# EAGLE design realParking (EAGLE 6.5.0)
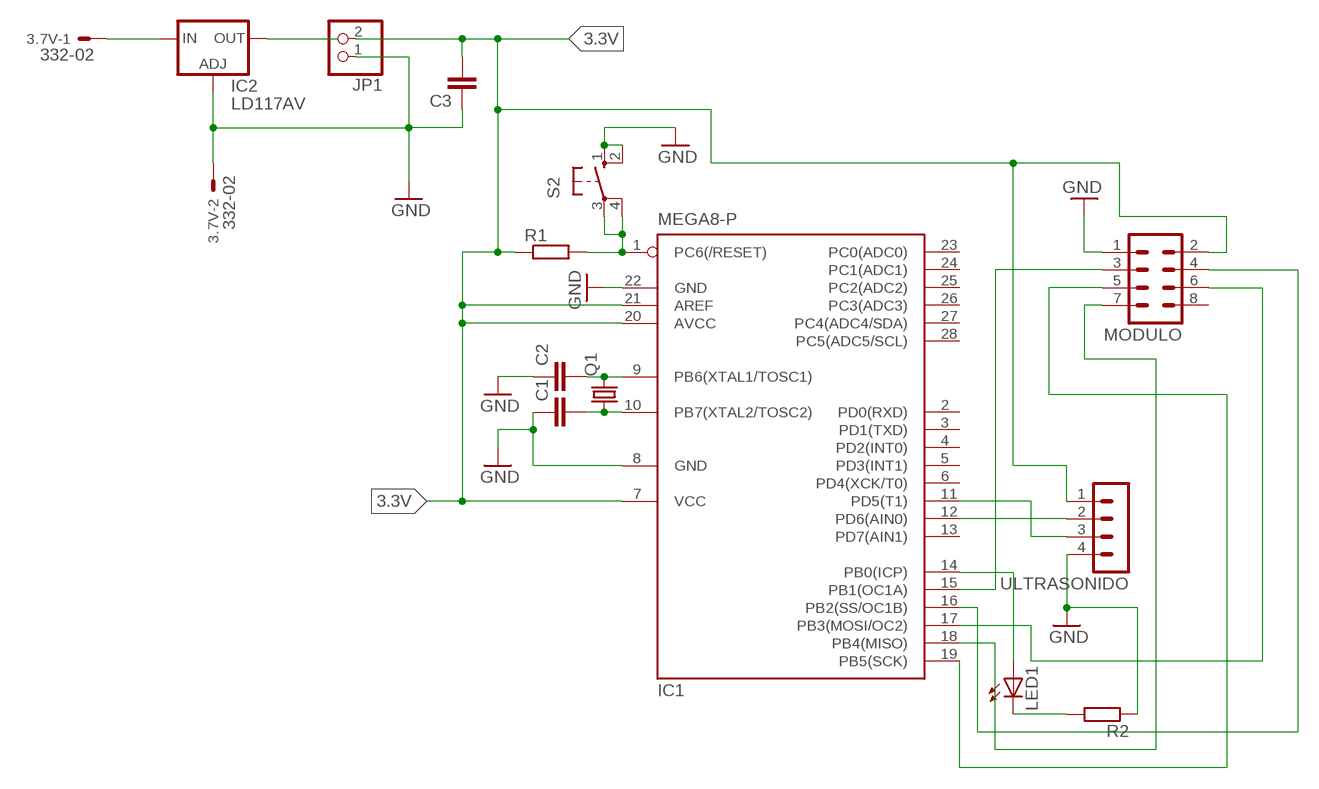
[diagram p0: schematic, sheet 1]

## Parts
3.7V  332-02  [332-02]
C1  C2,5-3  [C2.5-3]
C2  C2,5-3  [C2.5-3]
C3  C2,5-3  [C2.5-3]
IC1  MEGA8-P  [DIL28-3]
IC2  LD117AV  [TO220L1]
JP1  PINHD-1X2  [1X02]
LED1  LED5MM  [LED5MM]
MODULO  MA04-2  [MA04-2]
Q1  CRYSTALTC26V  [TC26V]
R1  R-EU_0204/5  [0204/5]
R2  R-EU_0204/5  [0204/5]
S2  10-XX  [B3F-10XX]
ULTRASONIDO  MA04-1  [MA04-1]

## Nets
3.3V: C3.2 IC1.7(VCC) IC1.20(AVCC) IC1.21(AREF) JP1.2 MODULO.2 R1.1 ULTRASONIDO.1
GND: 3.7V.2 C1.1 C2.1 C3.1 IC1.8(GND) IC1.22(GND) IC2.1(ADJ) JP1.1 MODULO.1 R2.1 S2.1(S) S2.2(S1) ULTRASONIDO.4
N$1: IC2.2(OUT)
N$2: 3.7V.1 IC2.3(IN)
N$3: IC1.12(PD6(AIN0)) ULTRASONIDO.2
N$4: IC1.11(PD5(T1)) ULTRASONIDO.3
N$6: LED1.K(C) R2.2
N$8: IC1.14(PB0(ICP)) LED1.A
N$9: IC1.15(PB1(OC1A)) MODULO.3
N$10: IC1.16(PB2(SS/OC1B)) MODULO.4
N$11: IC1.17(PB3(MOSI/OC2)) MODULO.6
N$12: IC1.18(PB4(MISO)) MODULO.7
N$13: IC1.19(PB5(SCK)) MODULO.5
N$14: C2.2 IC1.9(PB6(XTAL1/TOSC1)) Q1.2
N$15: C1.2 IC1.10(PB7(XTAL2/TOSC2)) Q1.1
N$16: IC1.1(PC6(/RESET)) R1.2 S2.3(P) S2.4(P1)
Unconnected: IC1.2(PD0(RXD)) IC1.3(PD1(TXD)) IC1.4(PD2(INT0)) IC1.5(PD3(INT1)) IC1.6(PD4(XCK/T0)) IC1.13(PD7(AIN1)) IC1.23(PC0(ADC0)) IC1.24(PC1(ADC1)) IC1.25(PC2(ADC2)) IC1.26(PC3(ADC3)) IC1.27(PC4(ADC4/SDA)) IC1.28(PC5(ADC5/SCL)) MODULO.8

## Library data of the parts
3.7V = con-garry:332-02: 2 Pin - 2mm Dual Row Source: www.mpe-connector.de / garry_shortform_2012.pdf
C1-C3 = capacitor-wima:C: CAPACITOR naming: grid - package width
IC1 = atmel:MEGA8-P: MICROCONTROLLER 8 Kbytes FLASH, 1 kbytes SRAM, 512 bytes EEPROM, USART, 4-channel 10 bit ADC, 2-channel 8 bit ADC Pin compatible with Atmega48, ATMega88, ATMega168 Source: avr.lbr; OC_FARNELL: unknown; OC_NEWARK: unknown
IC2 = v-reg:LD117A?*: Low drop fixed and adjustable positive voltage regulators 1 A Source: http://www.st.com/stonline/products/literature/ds/7194/ld1117axx.pdf
JP1 = pinhead:PINHD-1X2: PIN HEADER
LED1 = led:LED: LED OSRAM: - CHIPLED LG R971, LG N971, LY N971, LG Q971, LY Q971, LO R971, LY R971 LH N974, LH R974 LS Q976, LO Q976, LY Q976 LO Q996 - Hyper CHIPLED LW Q18S LB Q993, LB Q99A, LB R99A - SideLED LS A670, LO A670, LY A670, LG A670, LP A670 LB A673, LV A673, LT A673, LW A673 LH A674 LY A675 LS A676, LA A676, LO A676, LY A676, LW A676 LS A679, LY A679, LG A679 - Hyper Micro SIDELED® LS Y876, LA Y876, LO Y876, LY Y876 LT Y87S - SmartLED LW L88C, LW L88S LB L89C, LB L89S, LG L890 LS L89K, LO L89K, LY L89K LS L896, LA L896, LO L896, LY L896 - TOPLED LS T670, LO T670, LY T670, LG T670, LP T670 LSG T670, LSP T670, LSY T670, LOP T670, LYG T670 LG T671, LOG T671, LSG T671 LB T673, LV T673, LT T673, LW T673 LH T674 LS T676, LA T676, LO T676, LY T676, LB T676, LH T676, LSB T676, LW T676 LB T67C, LV T67C, LT T67C, LS T67K, LO T67K, LY T67K, LW E67C LS E67B, LA E67B, LO E67B, LY E67B, LB E67C, LV E67C, LT E67C LW T67C LS T679, LY T679, LG T679 LS T770, LO T770, LY T770, LG T770, LP T770 LB T773, LV T773, LT T773, LW T773 LH T774 LS E675, LA E675, LY E675, LS T675 LS T776, LA T776, LO T776, LY T776, LB T776 LHGB T686 LT T68C, LB T68C - Hyper Mini TOPLED® LB M676 - Mini TOPLED Santana® LG M470 LS M47K, LO M47K, LY M47K Source: http://www.osram.convergy.de LUXEON: - LUMILED® LXK2-PW12-R00, LXK2-PW12-S00, LXK2-PW14-U00, LXK2-PW14-V00 LXK2-PM12-R00, LXK2-PM12-S00, LXK2-PM14-U00 LXK2-PE12-Q00, LXK2-PE12-R00, LXK2-PE12-S00, LXK2-PE14-T00, LXK2-PE14-U00 LXK2-PB12-K00, LXK2-PB12-L00, LXK2-PB12-M00, LXK2-PB14-N00, LXK2-PB14-P00, LXK2-PB14-Q00 LXK2-PR12-L00, LXK2-PR12-M00, LXK2-PR14-Q00, LXK2-PR14-R00 LXK2-PD12-Q00, LXK2-PD12-R00, LXK2-PD12-S00 LXK2-PH12-R00, LXK2-PH12-S00 LXK2-PL12-P00, LXK2-PL12-Q00, LXK2-PL12-R00 Source: www.luxeon.com KINGBRIGHT: KA-3528ASYC Source: www.kingbright.com
MODULO = con-lstb:MA04-2: PIN HEADER; OC_FARNELL: unknown; OC_NEWARK: unknown
Q1 = crystal:CRYSTAL: CRYSTAL; OC_FARNELL: unknown; OC_NEWARK: unknown
R1 R2 = rcl:R-EU_: RESISTOR, European symbol
S2 = switch-omron:10-XX: OMRON SWITCH; MPN: B3F-1000; OC_FARNELL: 176432; OC_NEWARK: 36M3542
ULTRASONIDO = con-lstb:MA04-1: PIN HEADER; OC_FARNELL: unknown; OC_NEWARK: unknown

## Board
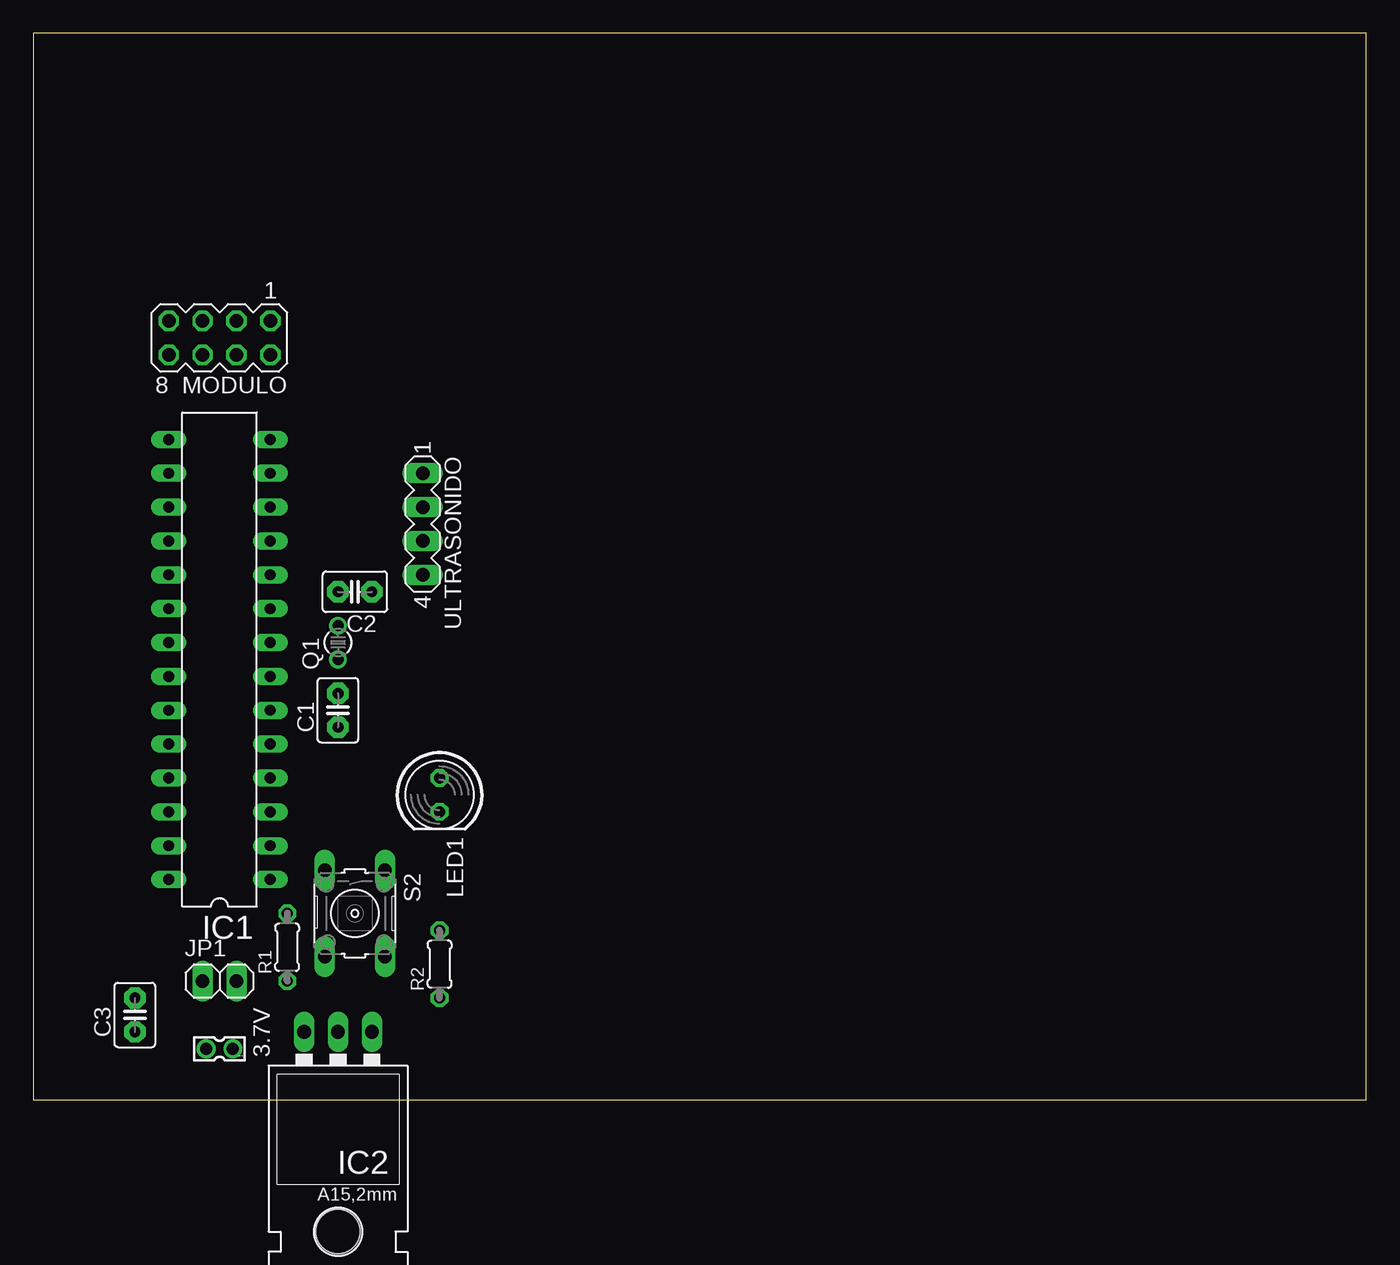
[diagram p1: board, top side]
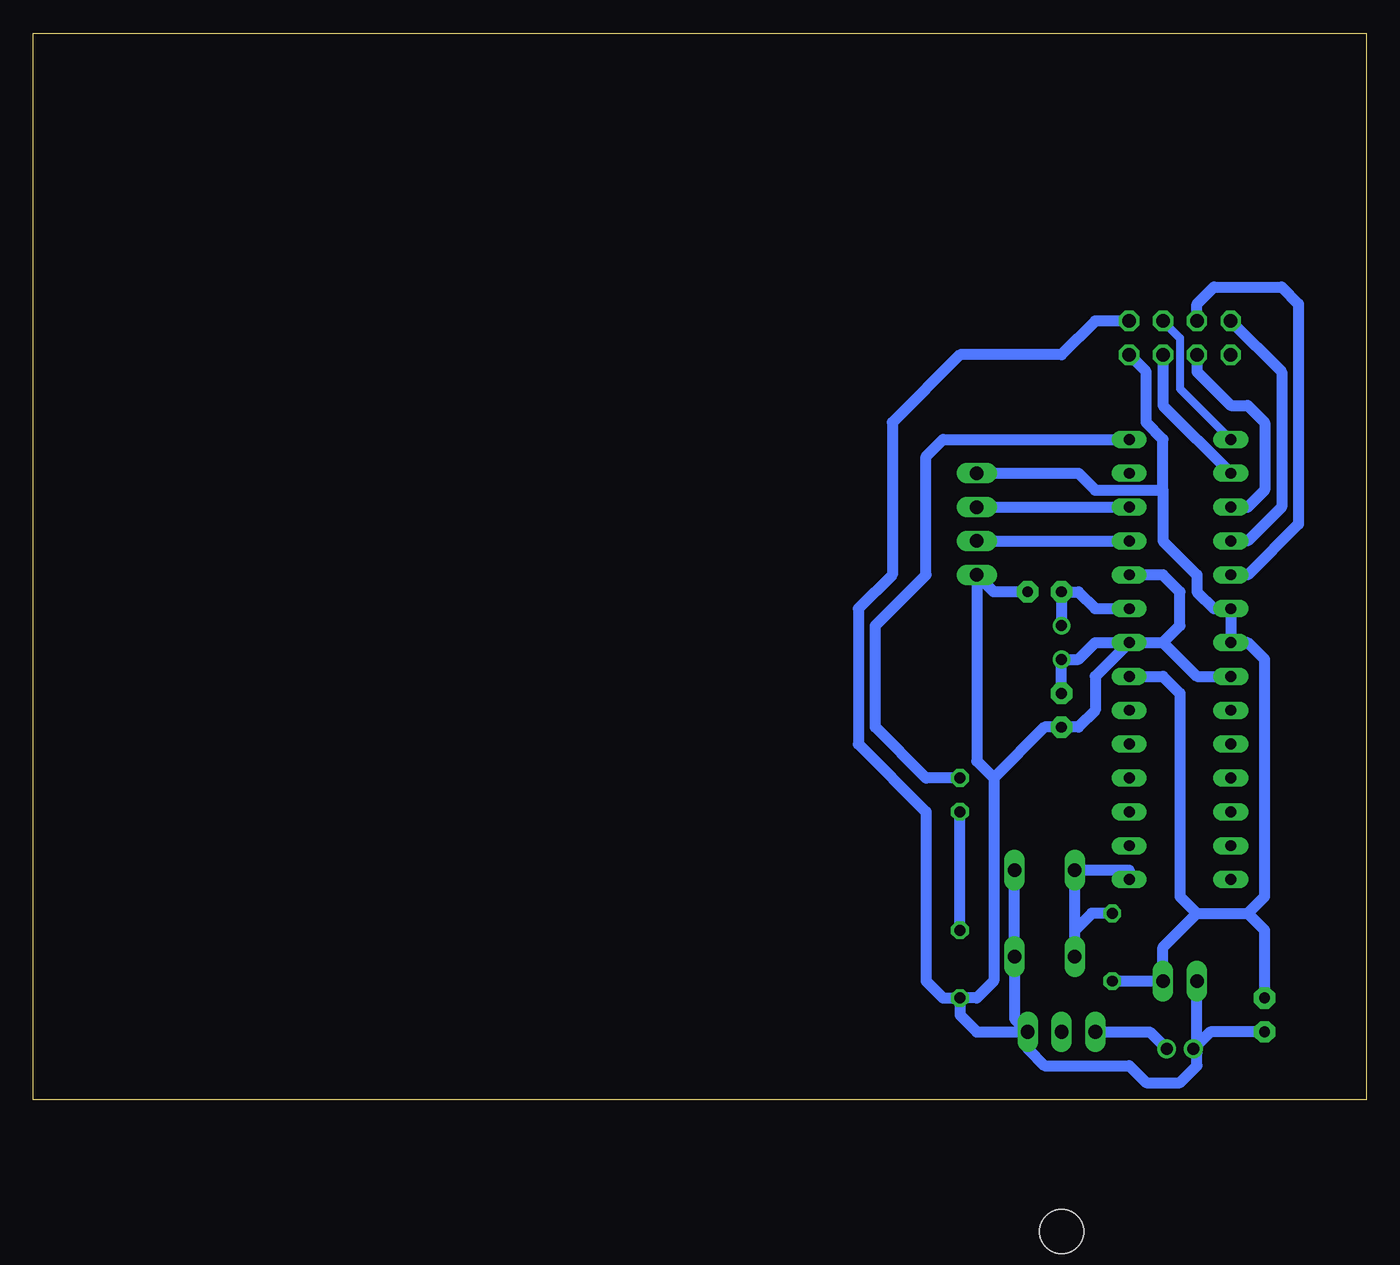
[diagram p2: board, bottom side, seen from below]

Size 100 x 80 mm. Coordinates in mm from the lower left corner, seen from the top.
Outline: 0,0 100,0 100,80 0,80 0,0
Copper layers (1*16): Top 0.035mm / dielectric 1.5mm / Bottom 0.035mm
Design rules "default": minimum track width 10mil, minimum drill 24mil, track to track 8mil, track to pad 8mil, pad to pad 8mil, via to via 8mil, smd to smd 8mil, copper to edge 40mil, drill to drill 8mil, minimum pad ring 10mil, minimum via ring 8mil, stop-mask expansion 4mil, vias tented up to drill 0mil, thermal gap 10mil

### Footprints (pad centres in the part's own frame; a part is rotated, then mirrored left to right if it is on the bottom)
332-02 = drill 0.9 pad 1.27: 1 0,-1; 2 0,1
C2.5-3 = drill 0.813 pad 1.6 octagon: 1 -1.27,0; 2 1.27,0
DIL28-3 = drill 0.813 long: 1 -16.51,-3.81; 2 -13.97,-3.81; 3 -11.43,-3.81; 4 -8.89,-3.81; 5 -6.35,-3.81; 6 -3.81,-3.81; 7 -1.27,-3.81; 8 1.27,-3.81; 9 3.81,-3.81; 10 6.35,-3.81; 11 8.89,-3.81; 12 11.43,-3.81; 13 13.97,-3.81; 14 16.51,-3.81; 15 16.51,3.81; 16 13.97,3.81; 17 11.43,3.81; 18 8.89,3.81; 19 6.35,3.81; 20 3.81,3.81; 21 1.27,3.81; 22 -1.27,3.81; 23 -3.81,3.81; 24 -6.35,3.81; 25 -8.89,3.81; 26 -11.43,3.81; 27 -13.97,3.81; 28 -16.51,3.81
TO220L1 = drill 1.016 long: 1 -2.54,-3.81; 2 0,-3.81; 3 2.54,-3.81 | hole 3.302: 0,11.176
1X02 = drill 1.016 long: 1 -1.27,0; 2 1.27,0
LED5MM = drill 0.813 octagon: A -1.27,0; K 1.27,0
MA04-2 = drill 1.016 octagon: 1 -3.81,-1.27; 2 -3.81,1.27; 3 -1.27,-1.27; 4 -1.27,1.27; 5 1.27,-1.27; 6 1.27,1.27; 7 3.81,-1.27; 8 3.81,1.27
TC26V = drill 0.813: 1 -1.27,0; 2 1.27,0
0204/5 = drill 0.813 octagon: 1 -2.54,0; 2 2.54,0
B3F-10XX = drill 1.016 long: 1 -3.251,2.261; 2 3.251,2.261; 3 -3.251,-2.261; 4 3.251,-2.261
MA04-1 = drill 1.016 long: 1 -3.81,0; 2 -1.27,0; 3 1.27,0; 4 3.81,0

### Placement (x,y rotation side)
3.7V  13.97,3.81 90 top
C1  22.86,29.21 90 top
C2  24.13,38.1 180 top
C3  7.62,6.35 90 top
IC1  13.97,33.02 90 top
IC2  22.86,1.27 180 top
JP1  13.97,8.89 0 top
LED1  30.48,22.86 270 top
MODULO  13.97,57.15 180 top
Q1  22.86,34.29 90 top
R1  19.05,11.43 90 top
R2  30.48,10.16 90 top
S2  24.13,13.97 270 top
ULTRASONIDO  29.21,43.18 270 top

### Tracks (layer width: path | path; a pad name or v marks a point on that pad's centre or on a via)
3.3V
  Bottom 0.813: IC1.7 15.24,31.75 13.97,30.48 13.97,15.24 12.7,13.97 | 12.7,13.97 8.89,13.97 | 8.89,13.97 7.62,15.24 7.62,33.02 8.89,34.29 IC1.21 IC1.20 11.43,36.83 12.7,38.1 12.7,39.37 15.24,41.91 15.24,45.72 | 12.7,13.97 15.24,11.43 JP1.2 R1.1 | C3.2 7.62,12.7 8.89,13.97 | 15.24,45.72 15.24,49.53 16.51,50.8 16.51,54.61 MODULO.2 | ULTRASONIDO.1 21.59,46.99 20.32,45.72 15.24,45.72
GND
  Bottom 0.813: 3.7V.2 12.7,3.81 JP1.1 | S2.1 S2.2 26.39,6.07 IC2.1 | C2.1 27.94,38.1 ULTRASONIDO.4 29.21,25.4 27.94,24.13 | R2.1 30.48,6.35 29.21,5.08 IC2.1 | IC1.22 12.7,31.75 15.24,34.29 IC1.8 20.32,31.75 20.32,29.21 21.59,27.94 C1.1 24.13,27.94 27.94,24.13 | MODULO.1 20.32,58.42 22.86,55.88 30.48,55.88 35.56,50.8 35.56,39.37 38.1,36.83 38.1,26.67 33.02,21.59 33.02,8.89 31.75,7.62 R2.1 | C3.1 11.7,5.08 3.7V.2 | 27.94,24.13 27.94,8.89 29.21,7.62 R2.1 | IC2.1 25.4,3.81 24.13,2.54 17.78,2.54 16.51,1.27 13.97,1.27 12.7,2.54 12.7,3.54 3.7V.2
N$2
  Bottom 0.813: IC2.3 16.24,5.08 3.7V.1
N$3
  Bottom 0.813: ULTRASONIDO.2 IC1.12
N$4
  Bottom 0.813: ULTRASONIDO.3 IC1.11
N$6
  Bottom 0.813: R2.2 LED1.K
N$8
  Bottom 0.813: LED1.A 33.02,24.13 36.83,27.94 36.83,35.56 33.02,39.37 33.02,48.26 31.75,49.53 IC1.14
N$9
  Bottom 0.61: MODULO.3 13.97,57.15 13.97,53.34 IC1.15
N$10
  Bottom 0.813: MODULO.4 15.24,52.07 IC1.16
N$11
  Bottom 0.813: MODULO.6 12.7,54.61 10.16,52.07 8.89,52.07 7.62,50.8 7.62,45.72 8.89,44.45 IC1.17
N$12
  Bottom 0.813: MODULO.7 6.35,54.61 6.35,44.45 8.89,41.91 IC1.18
N$13
  Bottom 0.813: MODULO.5 12.7,59.69 11.43,60.96 6.35,60.96 5.08,59.69 5.08,43.18 8.89,39.37 IC1.19
N$14
  Bottom 0.813: Q1.2 C2.2 21.59,38.1 20.32,36.83 IC1.9
N$15
  Bottom 0.813: C1.2 Q1.1 21.59,33.02 20.32,34.29 15.24,34.29 13.97,35.56 13.97,38.1 15.24,39.37 IC1.10
N$16
  Bottom 0.813: IC1.1 17.78,17.22 S2.3 21.87,12.7 | S2.4 21.87,12.7 | R1.2 20.6,13.97 21.87,12.7